# Altium schematic sheet 15VDC 500mA Boost SMPS.SchDoc: 15VDC Boost SMPS
size A4; Date: 2017-07-12; Revision: A; DesignedBy: Craig Comberbach
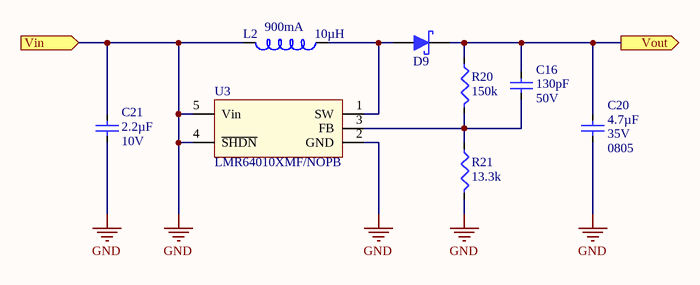
[diagram p0: 15VDC 500mA Boost SMPS.SchDoc]

## Parts
C16  Voltage - Rated: 50V  Capacitance: 130pF  (hidden comment: 130pF 0603 50V)
C20  Voltage - Rated: 35V  Package / Case: 0805  Capacitance: 4.7µF
C21  Capacitance: 2.2µF  Voltage - Rated: 10V  (hidden comment: 2.2uF 0603 10V)
D9  Schottky Diode 60V 3A  [SMA - Diode]  (value not drawn)
L2  Inductance: 10µH  Current - Saturation: 900mA  (hidden comment: 10uH 1210 900mA)
R20  Resistance (Ohms): 150k  [R0603]  (hidden comment: 150k 0603 1%)
R21  Resistance (Ohms): 13.3k  [R0603]  (hidden comment: 13.3k 0603 1%)
U3  Manufacturer Part Number: LMR64010XMF/NOPB

## Ports
Vin (in), Vout (out)

## Nets
GND: C20.2 C21.1 C21.2 L2.2 R21.1 U3.2(GND) U3.4(~{SHDN}) U3.5(Vin) ; port Vin
Vout: C16.2 C20.1 D9.2 R20.2 ; port Vout
NetC16_1: C16.1 R20.1 R21.2 U3.3(FB)
NetD9_1: D9.1 L2.1 U3.1(SW)

## Notes on the sheet
- Repository Version
- BOM/Variant

## Library data of the parts
C16 = 130pF 0603 50V: Non-polarized; Manufacturer: Samsung Electro-Mechanics America, Inc.; Manufacturer Part Number: CL10C131JB8NNNC; Tolerance: ±5%; Temperature Coefficient: C0G, NP0; RoHS: RoHS Compliant; Category: Capacitors; Mounting Type: Surface Mount, MLCC; Operating Temperature: -55°C ~ 125°C; Applications: General Purpose; Ratings: -; Package / Case: 0603 (1608 Metric); Size / Dimension: 0.063" L x 0.031" W (1.60mm x 0.80mm); Height - Seated (Max): -; Thickness (Max): 0.035" (0.90mm); Lead Spacing: -; Features: -; Lead Style: -; ComponentLink1URL: http://media.digikey.com/pdf/Data%20Sheets/Samsung%20PDFs/CL_Series_MLCC_ds.pdf; ComponentLink1Description: Spec Sheet; Value: 130pF 0603 50V; Supplier 1: Digi-Key; Stock 1: 72882; Pricing 1: 1=0.1, 10=0.056, 100=0.0251, 500=0.0179, 1000=0.01407 (USD); Packaging: Cut Tape (CT); Supplier Part Number 1: 1276-2186-1-ND; Part Status: Active
C20 = 4.7uF 0805 35V: Non-polarized; Manufacturer: Samsung Electro-Mechanics America, Inc.; Manufacturer Part Number: CL21A475KLCLQNC; Tolerance: ±10%; Temperature Coefficient: X5R; Value: 4.7uF 0805 35V; Supplier 1: Digi-Key; Supplier Part Number 1: 1276-6722-1-ND; RoHS: RoHS Compliant; Category: Capacitors; Stock 1: 145582; Pricing 1: 1=0.17, 10=0.119, 100=0.0561, 500=0.03932, 1000=0.03255 (USD); Packaging: Cut Tape (CT); Mounting Type: Surface Mount, MLCC; Operating Temperature: -55°C ~ 85°C; Applications: General Purpose; Ratings: -; Size / Dimension: 0.079" L x 0.049" W (2.00mm x 1.25mm); Height - Seated (Max): -; Thickness (Max): 0.037" (0.95mm); Lead Spacing: -; Features: Low Profile; Lead Style: -; ComponentLink1URL: http://www.samsungsem.com/kr/support/library/product-catalog/mlcc.jsp; ComponentLink1Description: Spec Sheet; Part Status: Active
C21 = 2.2uF 0603 10V: Polarized; Manufacturer: Taiyo Yuden; Manufacturer Part Number: LMK107B7225KA-T; Tolerance: ±10%; Temperature Coefficient: X7R; Value: 2.2uF 0603 10V; ComponentLink1URL: http://media.digikey.com/pdf/Data%20Sheets/Taiyo%20Yuden%20PDFs%20URL%20links/LMK107B7225KA-T.pdf; ComponentLink1Description: Spec Sheet; Supplier 1: Digi-Key; Supplier Part Number 1: 587-2983-1-ND; RoHS: RoHS Compliant; Packaging: Cut Tape (CT); Operating Temperature: -55°C ~ 125°C; Mounting Type: Surface Mount, MLCC; Package / Case: 0603 (1608 Metric); Size / Dimension: 0.063" L x 0.031" W (1.60mm x 0.80mm); Height - Seated (Max): -; Lead Spacing: -; Features: -; Category: Capacitors; Stock 1: 348987; Pricing 1: 1=0.19, 10=0.135, 100=0.0633, 500=0.04438, 1000=0.03675 (USD); Part Status: Active; Ratings: -; Applications: General Purpose; Thickness (Max): 0.035" (0.90mm); Lead Style: -
D9 = Schottky Diode 60V 3A: Schottky Diode; Manufacturer: Diodes Incorporated; Manufacturer Part Number: B360A-13-F; Voltage - Forward (Vf) (Max) @ If: 700mV @ 3A; Speed: Fast Recovery =< 500ns, > 200mA (Io); Current - Reverse Leakage @ Vr: 500µA @ 60V; Capacitance @ Vr, F: 200pF @ 4V, 1MHz; Price P/N: 020107-024; Technology: SMT; Value: Schottky Diode 60V 3A; Supplier 1: Digi-Key; Supplier Part Number 1: B360A-FDICT-ND; RoHS: RoHS Compliant; Category: Discrete Semiconductor Products; Stock 1: 36234; Pricing 1: 1=0.63, 10=0.51, 25=0.4468, 100=0.3828, 250=0.3306, 500=0.2842, 1000=0.21609, 2500=0.19903 (CAD); Packaging: Cut Tape (CT); Diode Type: Schottky; Voltage - DC Reverse (Vr) (Max): 60V; Current - Average Rectified (Io): 3A; Reverse Recovery Time (trr): -; Mounting Type: Surface Mount; Package / Case: DO-214AC, SMA; Supplier Device Package: SMA; Operating Temperature - Junction: -55°C ~ 150°C; ComponentLink1URL: http://www.diodes.com/datasheets/ds30891.pdf; ComponentLink1Description: Spec Sheet
L2 = 10uH 1210 900mA: Inductor; Manufacturer: Taiyo Yuden; Manufacturer Part Number: CBC3225T100KR; Type: Wirewound; Material - Core: Ferrite; Tolerance: ±10%; Shielding: Unshielded; DC Resistance (DCR): 172.9 mOhm Max; Frequency - Self Resonant: 23MHz; Value: 10uH 1210 900mA; Supplier 1: Digi-Key; Supplier Part Number 1: 587-3064-1-ND; RoHS: RoHS Compliant; Stock 1: 25536; Pricing 1: 1=0.27, 10=0.237, 25=0.2076, 50=0.178, 100=0.1632, 250=0.1484, 500=0.1395 (USD); Packaging: Cut Tape (CT); Current Rating: 900mA; Q @ Freq: -; Ratings: -; Operating Temperature: -40°C ~ 105°C; Mounting Type: Surface Mount; Package / Case: 1210; Size / Dimension: 0.126" L x 0.098" W (3.20mm x 2.50mm); Height - Seated (Max): 0.106" (2.70mm); ComponentLink1URL: http://ds.yuden.co.jp/TYCOMPAS/ut/detail.do?productNo=CBC3225T100KR&fileName=CBC3225T100KR_SS&mode=specSheetDownload; ComponentLink1Description: Spec Sheet; Category: Inductors, Coils, Chokes; Part Status: Active; Supplier Device Package: 1210
R20 = 150k 0603 1%: Manufacturer: Yageo; Manufacturer Part Number: RC0603FR-07150KL; Power (Watts): 0.1W, 1/10W; Temperature Coefficient: ±100ppm/°C; Value: 150k 0603 1%; Supplier 1: Digi-Key; Supplier Part Number 1: 311-150KHRCT-ND; RoHS: RoHS Compliant; Category: Resistors; Stock 1: 705809; Pricing 1: 1=0.1, 10=0.015, 100=0.006, 1000=0.00268, 2500=0.00233 (USD); Packaging: Cut Tape (CT); Tolerance: ±1%; Composition: Thick Film; Features: Moisture Resistant; Package / Case: 0603 (1608 Metric); Supplier Device Package: 0603; Size / Dimension: 0.063" L x 0.031" W (1.60mm x 0.80mm); ComponentLink1URL: http://www.yageo.com/documents/recent/PYu-RC_Group_51_RoHS_L_7.pdf; ComponentLink1Description: Spec Sheet; Part Status: Active; Operating Temperature: -55°C ~ 155°C; Height - Seated (Max): 0.022" (0.55mm); Failure Rate: -
R21 = 13.3k 0603 1%: Manufacturer: Yageo; Manufacturer Part Number: RC0603FR-0713K3L; Power (Watts): 0.1W, 1/10W; Temperature Coefficient: ±100ppm/°C; Value: 13.3k 0603 1%; Supplier 1: Digi-Key; RoHS: RoHS Compliant; Category: Resistors; Stock 1: 289877; Pricing 1: 1=0.1, 10=0.015, 100=0.006, 1000=0.00268, 2500=0.00233 (USD); Packaging: Cut Tape (CT); Tolerance: ±1%; Composition: Thick Film; Features: Moisture Resistant; Operating Temperature: -55°C ~ 155°C; Package / Case: 0603 (1608 Metric); Supplier Device Package: 0603; Size / Dimension: 0.063" L x 0.031" W (1.60mm x 0.80mm); ComponentLink1URL: http://www.yageo.com/documents/recent/PYu-RC_Group_51_RoHS_L_7.pdf; ComponentLink1Description: Spec Sheet; Supplier Part Number 1: 311-13.3KHRCT-ND; Part Status: Active; Height - Seated (Max): 0.022" (0.55mm); Failure Rate: -
U3 = SMPS Boost SOT23-5 LMR64010XMF/NOPB 2.7-14Vin 3-40Vout 1A 1.6MHz: LMR64010XMFE/NOPB; Manufacturer: Texas Instruments; Function: Step-Up; Output Configuration: Positive; Topology: Boost; Output Type: Adjustable; Number of Outputs: 1; Voltage - Input (Min): 2.7V; Voltage - Input (Max): 14V; Voltage - Output (Min/Fixed): 3V; Voltage - Output (Max): 40V (Switch); Current - Output: 1A (Switch); Frequency - Switching: 1.6MHz; Synchronous Rectifier: No; Value: SMPS Boost SOT23-5 LMR64010XMF/NOPB 2.7-14Vin 3-40Vout 1A 1.6MHz; Supplier 1: Digi-Key; Supplier Part Number 1: 296-38770-1-ND; RoHS: RoHS Compliant; Stock 1: 4980; Pricing 1: 1=2.46, 10=2.212, 100=1.7778, 500=1.46062 (CAD); Packaging: Cut Tape (CT); Operating Temperature: -40°C ~ 125°C (TJ); Mounting Type: Surface Mount; Package / Case: SC-74A, SOT-753; Supplier Device Package: SOT-23-5; ComponentLink1URL: http://www.ti.com/lit/ds/symlink/lmr64010.pdf; ComponentLink1Description: Spec Sheet; Category: Integrated Circuits (ICs); Part Status: Active